# Altium schematic sheet main.SchDoc: Main
size Letter; CheckedBy: J. Brinton; CompanyName: Signal Laboratories, Inc.; DrawnBy: J. Brinton; Engineer: J. Brinton; Address1: 3479 Edison Way; Address2: Menlo Park CA 94025; Address3: +1 (877) 778-8435; Address4: siglabs.com; Revision: 3; SheetNumber: 2; SheetTotal: 49
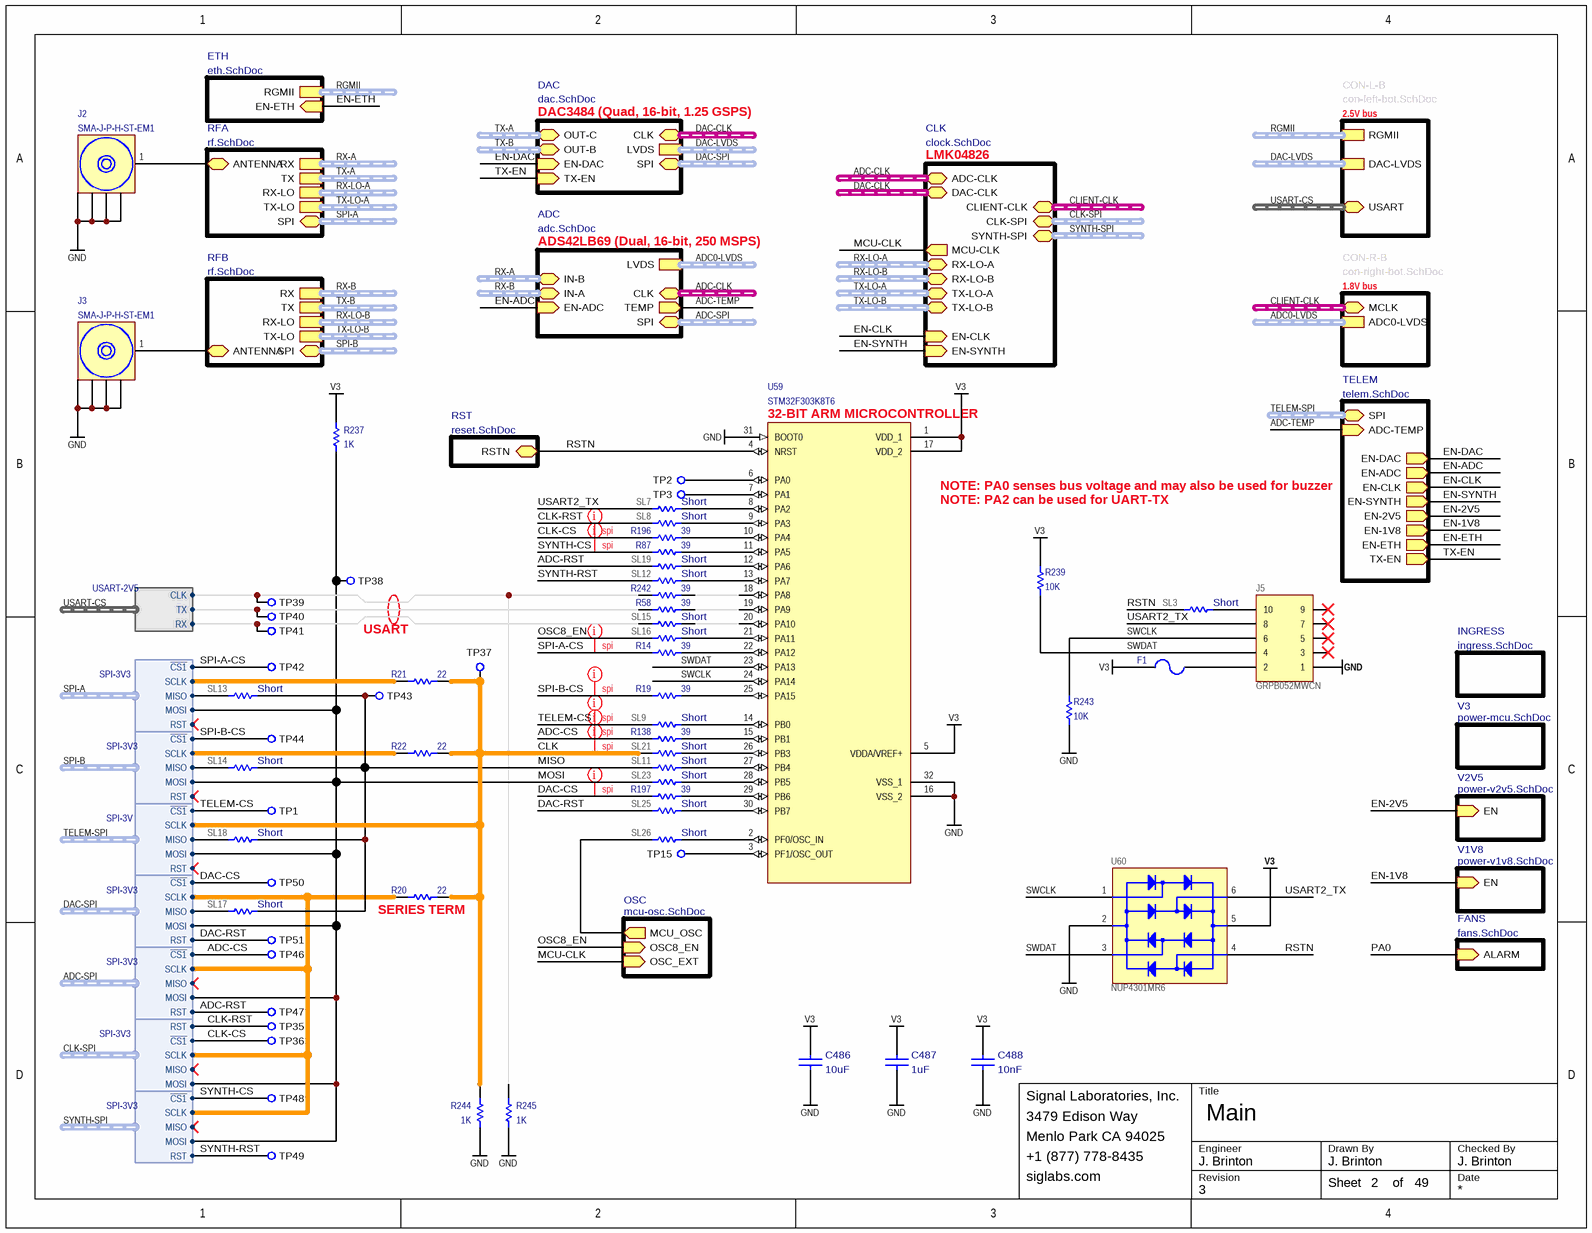
[diagram p0: main.SchDoc]

## Parts
C486  value 10uF  [CAPC200X125X145L45N]  (hidden comment: CL21B106KOQNNNE)
C487  value 1uF  [CAPC200X125X145L45N]  (hidden comment: TMK212B7105KG)
C488  value 10nF  [CAPC100X50X55L25N]  (hidden comment: GRM155R71H103KA88)
F1  0ZCJ0020FF2E  [1206]  (value not drawn)
J2  SMA-J-P-H-ST-EM1  [SMA-J-P-H-ST-EM1]
J3  SMA-J-P-H-ST-EM1  [SMA-J-P-H-ST-EM1]
J5  GRPB052MWCN  [GRPB052MWCN]
R14  value 39  [RESC1005X40N]  (hidden comment: RC0402FR-0739RL)
R19  value 39  [RESC1005X40N]  (hidden comment: RC0402FR-0739RL)
R20  value 22  [RESC1005X40N]  (hidden comment: RC0402FR-0722RL)
R21  value 22  [RESC1005X40N]  (hidden comment: RC0402FR-0722RL)
R22  value 22  [RESC1005X40N]  (hidden comment: RC0402FR-0722RL)
R58  value 39  [RESC1005X40N]  (hidden comment: RC0402FR-0739RL)
R87  value 39  [RESC1005X40N]  (hidden comment: RC0402FR-0739RL)
R138  value 39  [RESC1005X40N]  (hidden comment: RC0402FR-0739RL)
R196  value 39  [RESC1005X40N]  (hidden comment: RC0402FR-0739RL)
R197  value 39  [RESC1005X40N]  (hidden comment: RC0402FR-0739RL)
R237  value 1K  [RESC1005X40N]  (hidden comment: RC0402FR-071KL)
R239  value 10K  [RESC1005X40N]  (hidden comment: ERJ-2RKF1002X)
R242  value 39  [RESC1005X40N]  (hidden comment: RC0402FR-0739RL)
R243  value 10K  [RESC1005X40N]  (hidden comment: ERJ-2RKF1002X)
R244  value 1K  [RESC1005X40N]  (hidden comment: RC0402FR-071KL)
R245  value 1K  [RESC1005X40N]  (hidden comment: RC0402FR-071KL)
SL3  Notes: Short  [SOLDERLINK0603X26N_BRIDGED]  (hidden comment: SOLDER_LINK)  (no BOM)
SL7  Notes: Short  [SOLDERLINK0603X26N_BRIDGED]  (hidden comment: SOLDER_LINK)  (no BOM)
SL8  Notes: Short  [SOLDERLINK0603X26N_BRIDGED]  (hidden comment: SOLDER_LINK)  (no BOM)
SL9  Notes: Short  [SOLDERLINK0603X26N_BRIDGED]  (hidden comment: SOLDER_LINK)  (no BOM)
SL11  Notes: Short  [SOLDERLINK0603X26N_BRIDGED]  (hidden comment: SOLDER_LINK)  (no BOM)
SL12  Notes: Short  [SOLDERLINK0603X26N_BRIDGED]  (hidden comment: SOLDER_LINK)  (no BOM)
SL13  Notes: Short  [SOLDERLINK0603X26N_BRIDGED]  (hidden comment: SOLDER_LINK)  (no BOM)
SL14  Notes: Short  [SOLDERLINK0603X26N_BRIDGED]  (hidden comment: SOLDER_LINK)  (no BOM)
SL15  Notes: Short  [SOLDERLINK0603X26N_BRIDGED]  (hidden comment: SOLDER_LINK)  (no BOM)
SL16  Notes: Short  [SOLDERLINK0603X26N_BRIDGED]  (hidden comment: SOLDER_LINK)  (no BOM)
SL17  Notes: Short  [SOLDERLINK0603X26N_BRIDGED]  (hidden comment: SOLDER_LINK)  (no BOM)
SL18  Notes: Short  [SOLDERLINK0603X26N_BRIDGED]  (hidden comment: SOLDER_LINK)  (no BOM)
SL19  Notes: Short  [SOLDERLINK0603X26N_BRIDGED]  (hidden comment: SOLDER_LINK)  (no BOM)
SL21  Notes: Short  [SOLDERLINK0603X26N_BRIDGED]  (hidden comment: SOLDER_LINK)  (no BOM)
SL23  Notes: Short  [SOLDERLINK0603X26N_BRIDGED]  (hidden comment: SOLDER_LINK)  (no BOM)
SL25  Notes: Short  [SOLDERLINK0603X26N_BRIDGED]  (hidden comment: SOLDER_LINK)  (no BOM)
SL26  Notes: Short  [SOLDERLINK0603X26N_BRIDGED]  (hidden comment: SOLDER_LINK)  (no BOM)
TP1  TEST_POINT_SMD_50  [TEST_POINT_SMD_10]  (value not drawn)  (no BOM)
TP2  TEST_POINT_SMD_10  [TEST_POINT_SMD_10]  (value not drawn)  (no BOM)
TP3  TEST_POINT_SMD_10  [TEST_POINT_SMD_10]  (value not drawn)  (no BOM)
TP15  TEST_POINT_SMD_10  [TEST_POINT_SMD_10]  (value not drawn)  (no BOM)
TP35  TEST_POINT_SMD_50  [TEST_POINT_SMD_10]  (value not drawn)  (no BOM)
TP36  TEST_POINT_SMD_50  [TEST_POINT_SMD_10]  (value not drawn)  (no BOM)
TP37  TEST_POINT_SMD_50  [TEST_POINT_SMD_10]  (value not drawn)  (no BOM)
TP38  TEST_POINT_SMD_50  [TEST_POINT_SMD_10]  (value not drawn)  (no BOM)
TP39  TEST_POINT_SMD_50  [TEST_POINT_SMD_10]  (value not drawn)  (no BOM)
TP40  TEST_POINT_SMD_50  [TEST_POINT_SMD_10]  (value not drawn)  (no BOM)
TP41  TEST_POINT_SMD_50  [TEST_POINT_SMD_10]  (value not drawn)  (no BOM)
TP42  TEST_POINT_SMD_50  [TEST_POINT_SMD_10]  (value not drawn)  (no BOM)
TP43  TEST_POINT_SMD_50  [TEST_POINT_SMD_10]  (value not drawn)  (no BOM)
TP44  TEST_POINT_SMD_50  [TEST_POINT_SMD_10]  (value not drawn)  (no BOM)
TP46  TEST_POINT_SMD_50  [TEST_POINT_SMD_10]  (value not drawn)  (no BOM)
TP47  TEST_POINT_SMD_50  [TEST_POINT_SMD_10]  (value not drawn)  (no BOM)
TP48  TEST_POINT_SMD_50  [TEST_POINT_SMD_10]  (value not drawn)  (no BOM)
TP49  TEST_POINT_SMD_50  [TEST_POINT_SMD_10]  (value not drawn)  (no BOM)
TP50  TEST_POINT_SMD_50  [TEST_POINT_SMD_10]  (value not drawn)  (no BOM)
TP51  TEST_POINT_SMD_50  [TEST_POINT_SMD_10]  (value not drawn)  (no BOM)
U59  STM32F303K8T6  [QFP80P900X900X160-32N]
U60  NUP4301MR6  [SOT23-6]

## Sub-sheets
ADC = adc.SchDoc: LVDS (harness ADC-LVDS), CLK (harness CLK-LVPECL33-TERM), IN-B (harness DIFF100), IN-A (harness DIFF100), TEMP (out), SPI (harness SPI-3V3), EN-ADC (in)
CLK = clock.SchDoc: CLIENT-CLK (harness CLK-LVPECL33), ADC-CLK (harness CLK-LVPECL33-TERM), DAC-CLK (harness CLK-LVPECL33-TERM), RX-LO-A (harness CLK-LVPECL33-TERM), RX-LO-B (harness CLK-LVPECL33-TERM), CLK-SPI (harness SPI-3V3), SYNTH-SPI (harness SPI-3V3), TX-LO-A (harness CLK-LVDS), TX-LO-B (harness CLK-LVDS), EN-CLK (in), EN-SYNTH (in), MCU-CLK (out)
CON-L-B = con-left-bot.SchDoc: RGMII (harness RGMII), DAC-LVDS (harness DAC-LVDS), USART (harness USART-2V5)
CON-R-B = con-right-bot.SchDoc: MCLK (harness CLK-LVPECL33), ADC0-LVDS (harness ADC-LVDS)
DAC = dac.SchDoc: LVDS (harness DAC-LVDS), CLK (harness CLK-LVPECL33-TERM), OUT-B (harness DIFF100), OUT-C (harness DIFF100), SPI (harness SPI-3V3), EN-DAC (in), TX-EN (in)
ETH = eth.SchDoc: RGMII (harness RGMII), EN-ETH (in)
FANS = fans.SchDoc: ALARM (in)
INGRESS = ingress.SchDoc: no entries
OSC = mcu-osc.SchDoc: OSC8_EN (in), OSC_EXT (in), MCU_OSC (out)
RFA = rf.SchDoc: RX (harness DIFF100), TX (harness DIFF100), RX-LO (harness CLK-LVPECL33-TERM), ANTENNA, SPI (harness SPI-3V3), TX-LO (harness CLK-LVDS)
RFB = rf.SchDoc: RX (harness DIFF100), TX (harness DIFF100), RX-LO (harness CLK-LVPECL33-TERM), ANTENNA, SPI (harness SPI-3V3), TX-LO (harness CLK-LVDS)
RST = reset.SchDoc: RSTN (bidir)
TELEM = telem.SchDoc: ADC-TEMP (in), SPI (harness SPI-3V), EN-DAC (out), EN-ADC (out), EN-CLK (out), EN-SYNTH (out), EN-2V5 (out), EN-1V8 (out), EN-ETH (out), TX-EN (out)
V1V8 = power-v1v8.SchDoc: EN (in)
V2V5 = power-v2v5.SchDoc: EN (in)
V3 = power-mcu.SchDoc: no entries

## Harnesses
SPI-3V3: MOSI, MISO, SCLK, ~{CS1}, RST
USART-2V5: RX, TX, CLK
SPI-3V: MOSI, MISO, SCLK, ~{CS1}, RST

## Nets
GND: C486.2 C487.2 C488.2 J2.2(GND) J2.3(GND) J2.4(GND) J2.5(GND) J3.2(GND) J3.3(GND) J3.4(GND) J3.5(GND) J5.1 R243.1 R244.1 R245.1 U59.16(VSS_2) U59.31(BOOT0) U59.32(VSS_1) U60.2(VN)
V3: C486.1 C487.1 C488.1 F1.2 R237.2 R239.2 U59.1(VDD_1) U59.5(VDDA/VREF+) U59.17(VDD_2) U60.5(VP)
ADC-CS: R138.1 TP46.1 ; sheet ADC/SPI.~{CS1}
ADC-RST: SL19.2 TP47.1 ; sheet ADC/SPI.RST
ADC-SPI.SCLK: R20.1 ; sheet ADC/SPI.SCLK, sheet CLK/CLK-SPI.SCLK, sheet CLK/SYNTH-SPI.SCLK, sheet DAC/SPI.SCLK
ADC-TEMP: sheet ADC/TEMP, sheet TELEM/ADC-TEMP
CLK: R20.2 R21.2 R22.2 R244.2 SL21.2 TP37.1 ; sheet TELEM/SPI.SCLK
CLK-CS: R196.1 TP36.1 ; sheet CLK/CLK-SPI.~{CS1}
CLK-RST: SL8.2 TP35.1 ; sheet CLK/CLK-SPI.RST
DAC-CS: R197.1 TP50.1 ; sheet DAC/SPI.~{CS1}
DAC-RST: SL25.2 TP51.1 ; sheet DAC/SPI.RST
DAC-SPI.MISO: SL17.2 ; sheet DAC/SPI.MISO
EN-1V8: sheet V1V8/EN, sheet TELEM/EN-1V8
EN-2V5: sheet V2V5/EN, sheet TELEM/EN-2V5
EN-ADC: sheet ADC/EN-ADC, sheet TELEM/EN-ADC
EN-CLK: sheet CLK/EN-CLK, sheet TELEM/EN-CLK
EN-DAC: sheet DAC/EN-DAC, sheet TELEM/EN-DAC
EN-ETH: sheet ETH/EN-ETH, sheet TELEM/EN-ETH
EN-SYNTH: sheet CLK/EN-SYNTH, sheet TELEM/EN-SYNTH
MCU-CLK: sheet CLK/MCU-CLK, sheet OSC/OSC_EXT
MISO: SL11.2 SL13.1 SL14.1 SL17.1 SL18.1 TP43.1
MOSI: R237.1 SL23.2 TP38.1 ; sheet RFA/SPI.MOSI, sheet RFB/SPI.MOSI, sheet ADC/SPI.MOSI, sheet CLK/CLK-SPI.MOSI, sheet CLK/SYNTH-SPI.MOSI, sheet DAC/SPI.MOSI, sheet TELEM/SPI.MOSI  [project net ADC-SPI.MOSI]
OSC8_EN: SL16.2 ; sheet OSC/OSC8_EN
PA0: sheet FANS/ALARM
RSTN: SL3.2 U59.4(NRST) U60.4(C) ; sheet RST/RSTN
SPI-A-CS: R14.1 TP42.1 ; sheet RFA/SPI.~{CS1}
SPI-A.MISO: SL13.2 ; sheet RFA/SPI.MISO
SPI-A.SCLK: R21.1 ; sheet RFA/SPI.SCLK
SPI-B-CS: R19.1 TP44.1 ; sheet RFB/SPI.~{CS1}
SPI-B.MISO: SL14.2 ; sheet RFB/SPI.MISO
SPI-B.SCLK: R22.1 ; sheet RFB/SPI.SCLK
SWCLK: J5.6 R243.2 U59.24(PA14) U60.1(A)
SWDAT: J5.4 R239.1 U59.23(PA13) U60.3(B)
SYNTH-CS: R87.1 TP48.1 ; sheet CLK/SYNTH-SPI.~{CS1}
SYNTH-RST: SL12.2 TP49.1 ; sheet CLK/SYNTH-SPI.RST
TELEM-CS: SL9.2 TP1.1 ; sheet TELEM/SPI.~{CS1}
TELEM-SPI.MISO: SL18.2 ; sheet TELEM/SPI.MISO
TX-EN: sheet DAC/TX-EN, sheet TELEM/TX-EN
USART2_TX: J5.8 SL7.2 U60.6(D)
USART-CS.CLK: R242.1 R245.2 TP39.1 ; sheet CON-L-B/USART.CLK
USART-CS.RX: SL15.2 TP41.1 ; sheet CON-L-B/USART.RX
USART-CS.TX: R58.1 TP40.1 ; sheet CON-L-B/USART.TX
NetF1_1: F1.1 J5.2
NetJ2_1: J2.1(CENTER) ; sheet RFA/ANTENNA
NetJ3_1: J3.1(CENTER) ; sheet RFB/ANTENNA
NetJ5_10: J5.10 SL3.1
NetR14_2: R14.2 U59.22(PA12)
NetR19_2: R19.2 U59.25(PA15)
NetR58_2: R58.2 U59.19(PA9)
NetR87_2: R87.2 U59.11(PA5)
NetR138_2: R138.2 U59.15(PB1)
NetR196_2: R196.2 U59.10(PA4)
NetR197_2: R197.2 U59.29(PB6)
NetR242_2: R242.2 U59.18(PA8)
NetSL7_1: SL7.1 U59.8(PA2)
NetSL8_1: SL8.1 U59.9(PA3)
NetSL9_1: SL9.1 U59.14(PB0)
NetSL11_1: SL11.1 U59.27(PB4)
NetSL12_1: SL12.1 U59.13(PA7)
NetSL15_1: SL15.1 U59.20(PA10)
NetSL16_1: SL16.1 U59.21(PA11)
NetSL19_1: SL19.1 U59.12(PA6)
NetSL21_1: SL21.1 U59.26(PB3)
NetSL23_1: SL23.1 U59.28(PB5)
NetSL25_1: SL25.1 U59.30(PB7)
NetSL26_1: SL26.1 U59.2(PF0/OSC_IN)
NetSL26_2: SL26.2 ; sheet OSC/MCU_OSC
NetTP2_1: TP2.1 U59.6(PA0)
NetTP3_1: TP3.1 U59.7(PA1)
NetTP15_1: TP15.1 U59.3(PF1/OSC_OUT)

Not connected (* = marked no-connect by the designer): J5 3* 5* 7* 9*

## Buses and harness runs
harness ADC0-LVDS = sheet ADC/LVDS
harness ADC0-LVDS = sheet CON-R-B/ADC0-LVDS
harness ADC-CLK = sheet ADC/CLK
harness ADC-CLK = sheet CLK/ADC-CLK
harness ADC-SPI = sheet ADC/SPI
harness CLIENT-CLK = sheet CLK/CLIENT-CLK
harness CLIENT-CLK = sheet CON-R-B/MCLK
harness CLK-SPI = sheet CLK/CLK-SPI
harness DAC-CLK = sheet CLK/DAC-CLK
harness DAC-CLK = sheet DAC/CLK
harness DAC-LVDS = sheet CON-L-B/DAC-LVDS
harness DAC-LVDS = sheet DAC/LVDS
harness DAC-SPI = sheet DAC/SPI
harness RGMII = sheet CON-L-B/RGMII
harness RGMII = sheet ETH/RGMII
harness RX-A = sheet ADC/IN-B
harness RX-A = sheet RFA/RX
harness RX-B = sheet ADC/IN-A
harness RX-B = sheet RFB/RX
harness RX-LO-A = sheet CLK/RX-LO-A
harness RX-LO-A = sheet RFA/RX-LO
harness RX-LO-B = sheet CLK/RX-LO-B
harness RX-LO-B = sheet RFB/RX-LO
harness SPI-A = sheet RFA/SPI
harness SPI-B = sheet RFB/SPI
harness SYNTH-SPI = sheet CLK/SYNTH-SPI
harness TELEM-SPI = sheet TELEM/SPI
harness TX-A = sheet DAC/OUT-C
harness TX-A = sheet RFA/TX
harness TX-B = sheet DAC/OUT-B
harness TX-B = sheet RFB/TX
harness TX-LO-A = sheet CLK/TX-LO-A
harness TX-LO-A = sheet RFA/TX-LO
harness TX-LO-B = sheet CLK/TX-LO-B
harness TX-LO-B = sheet RFB/TX-LO
harness USART-CS = sheet CON-L-B/USART

## Layout directives
net class spi: ADC-CS, CLK, CLK-CS, DAC-CS, SPI-A-CS, SPI-B-CS, SYNTH-CS, TELEM-CS

## Notes on the sheet
- DAC3484 (Quad, 16-bit, 1.25 GSPS)
- LMK04826
- 2.5V bus
- ADS42LB69 (Dual, 16-bit, 250 MSPS)
- 1.8V bus
- (near U59) 32-BIT ARM MICROCONTROLLER
- (near U59) NOTE: PA2 can be used for UART-TX
- (near U59) NOTE: PA0 senses bus voltage and may also be used for buzzer
- USART
- (near R20) SERIES TERM
- Title
- Engineer
- Revision
- Drawn By
- Checked By
- Date
- Sheet
- of

## Library data of the parts
C486 = LMK212B7106KG: Ceramic Capacitor 10uF ±10% 16V X7R 0805; Manufacturer: Samsung; Tr: -55:105; Manufacturer P/N: CL21B106KOQNNNE; Tolerance: ±10%; Package: 0805; Voltage: 16V
C487 = TMK212B7105KG: Ceramic Capacitor 1uF ±10% 25V X7R 0805; Manufacturer: Taiyo Yuden; Manufacturer P/N: TMK212B7105KG; Tolerance: ±10%; Tr: *; Package: 0805; Voltage: 25V
C488 = TMK105B7103KV: Ceramic Capacitor 10nF ±10% 50V X7R 0402; Manufacturer: Murata; Tr: -55:125; Manufacturer P/N: GRM155R71H103KA88; Tolerance: ±10%; Package: 0402; Voltage: 50V
F1 = 0ZCJ0020FF2E: PTC Resettable Fuse, 0.2A, 30V, SMD 1206; Manufacturer: Bell Fuse; Manufacturer P/N: 0ZCJ0020FF2E; Package: 1206
J2 J3 = 132136: Edge Mount SMA Jack, Female Socket; Manufacturer: Samtec; Manufacturer P/N: SMA-J-P-H-ST-EM1
J5 = GRPB052VWVN: Male Header, 0.050" Pitch, 2x5 Position, Right Angle; Manufacturer: Sullins; Manufacturer P/N: GRPB052MWCN
R14 R19 R58 R87 R138 R196 R197 R242 = RES 0402: Thick Film Resistor 39 ±1% 0402; Manufacturer: Yageo; Tr: -55:155; Package: 0402; Manufacturer P/N: RC0402FR-0739RL; Do Not Place: *; Tolerance: ±1%
R20-R22 = RES 0402: Thick Film Resistor 22 ±1% 0402; Manufacturer: Yageo; Tr: -55:155; Package: 0402; Manufacturer P/N: RC0402FR-0722RL; Do Not Place: *; Tolerance: ±1%
R237 R244 R245 = RES 0402: Thick Film Resistor 1k ±1% 0402; Manufacturer: Yageo; Tr: -55:155; Package: 0402; Manufacturer P/N: RC0402FR-071KL; Do Not Place: *; Tolerance: ±1%
R239 R243 = RES 0402: Thick Film Resistor 10k ±1% 0.1W 50V 0402; Manufacturer: Panasonic; Tr: -55:155; Package: 0402; Manufacturer P/N: ERJ-2RKF1002X; Tolerance: ±1%
SL3 SL7-SL9 SL11-SL19 SL21 SL23 SL25 SL26 = RES: Solder Link, Bridged
TP1 TP35-TP44 TP46-TP51 = TEST_POINT_SMD_50: Test Point SMD
TP2 TP3 TP15 = TEST_POINT_SMD_10: Test Point SMD
U59 = STM32F303K8T6: ARM Cortex-M4 MCU + FPU; Manufacturer: STMicroelectronics; Manufacturer P/N: STM32F303K8T6
U60 = NUP4301MR6: 4-Lane TVS Diode Array; Manufacturer: On Semiconductor; Manufacturer P/N: NUP4301MR6